# Altium schematic sheet Ethernet.SchDoc
size Legal; SheetNumber: 6; SheetTotal: 11
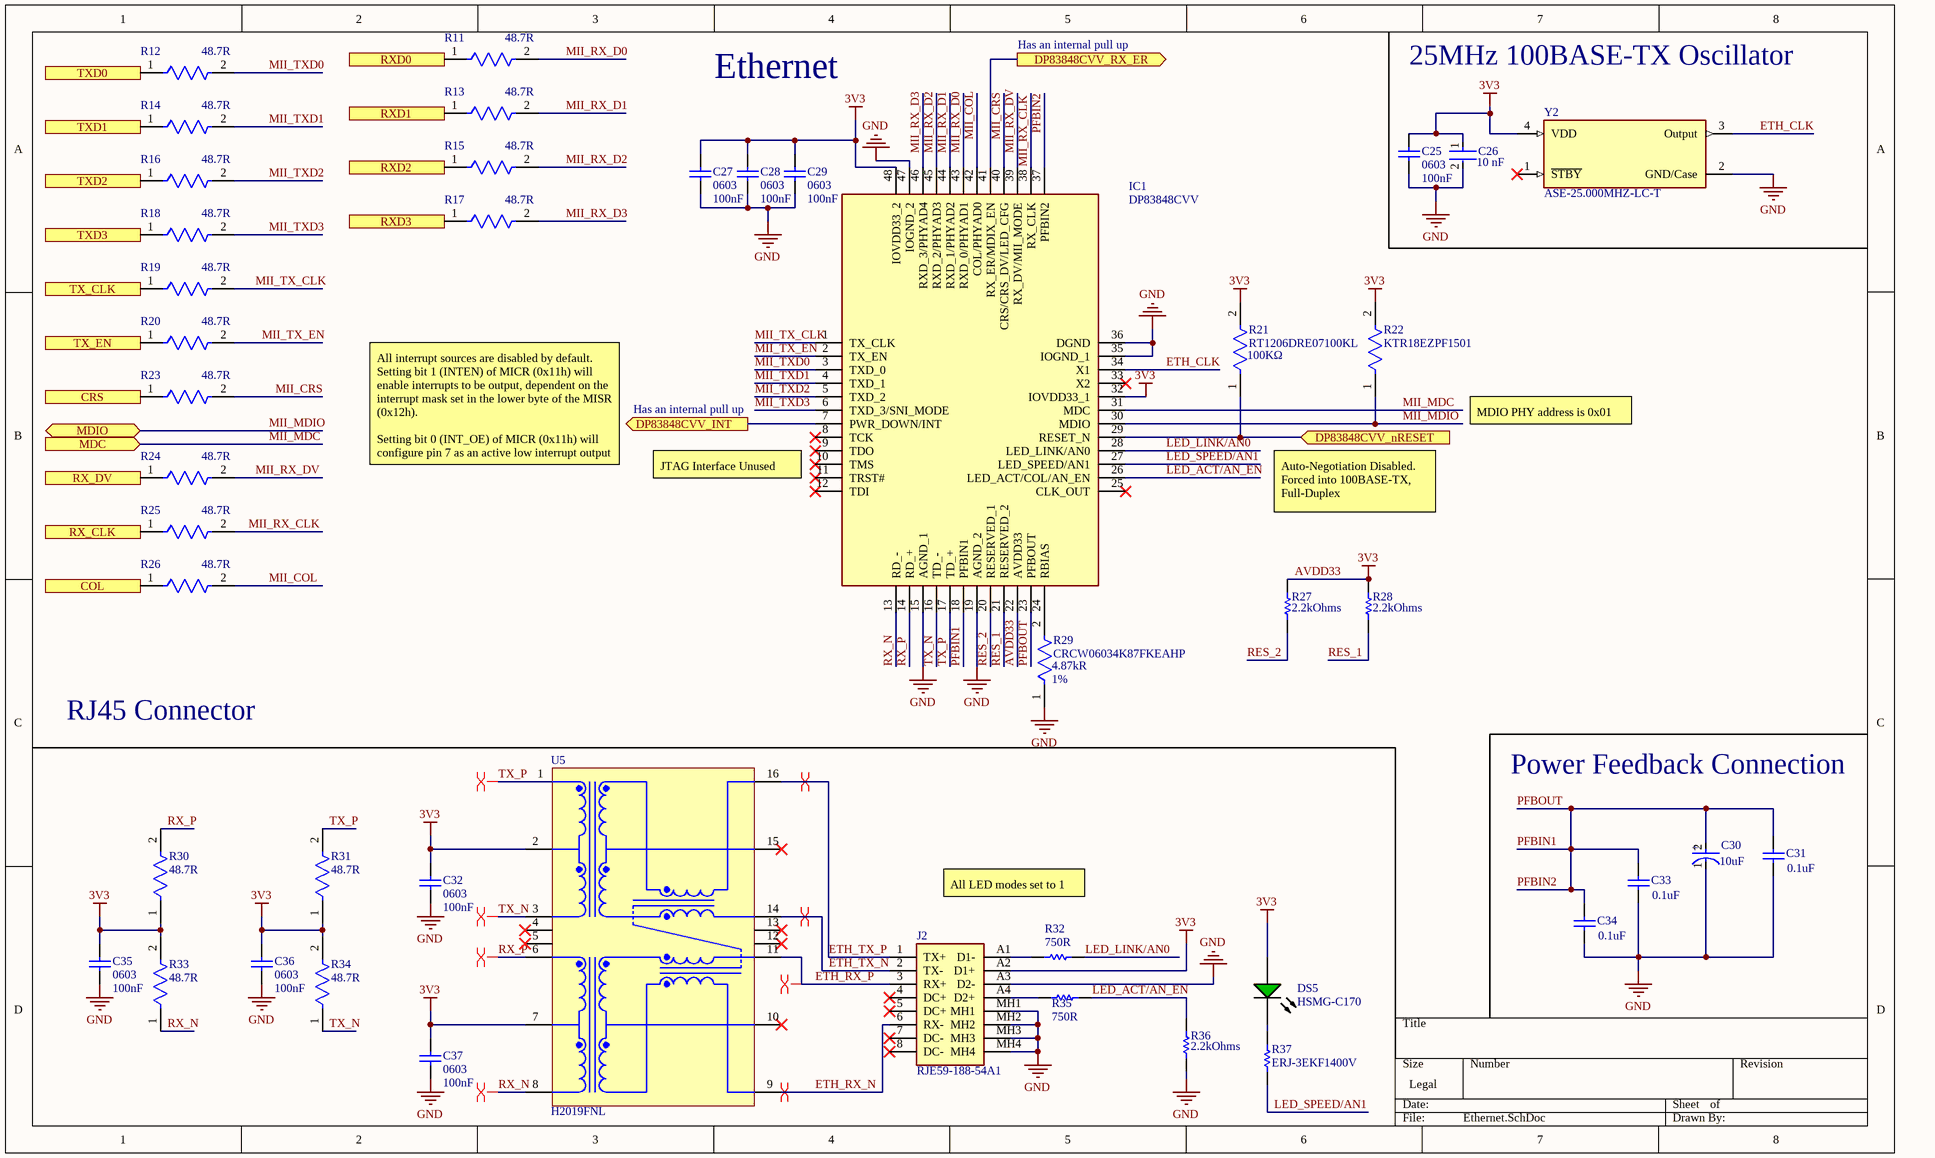
[diagram p0: Ethernet.SchDoc]

## Parts
C25  Case Code (Imperial): 0603  Capacitance: 100nF  [CAPC1608X87X35NL15T15]  (hidden comment: C0603X104K5RACTU)
C26  value 10 nF  [FP-CC0603-DA-MFG]  (hidden comment: CC0603KRX7R9BB103)
C27  Case Code (Imperial): 0603  Capacitance: 100nF  [CAPC1608X87X35NL15T15]  (hidden comment: C0603X104K5RACTU)
C28  Case Code (Imperial): 0603  Capacitance: 100nF  [CAPC1608X87X35NL15T15]  (hidden comment: C0603X104K5RACTU)
C29  Case Code (Imperial): 0603  Capacitance: 100nF  [CAPC1608X87X35NL15T15]  (hidden comment: C0603X104K5RACTU)
C30  Capacitance: 10uF  [FP-T491B106K025AT-MFG]  (hidden comment: T491B106K025AT)
C31  value 0.1uF  [CAPC2113X120X50NL20T30]  (hidden comment: TAJR104K020RNJ)
C32  Case Code (Imperial): 0603  Capacitance: 100nF  [CAPC1608X87X35NL15T15]  (hidden comment: C0603X104K5RACTU)
C33  value 0.1uF  [CAPC2113X120X50NL20T30]  (hidden comment: TAJR104K020RNJ)
C34  value 0.1uF  [CAPC2113X120X50NL20T30]  (hidden comment: TAJR104K020RNJ)
C35  Case Code (Imperial): 0603  Capacitance: 100nF  [CAPC1608X87X35NL15T15]  (hidden comment: C0603X104K5RACTU)
C36  Case Code (Imperial): 0603  Capacitance: 100nF  [CAPC1608X87X35NL15T15]  (hidden comment: C0603X104K5RACTU)
C37  Case Code (Imperial): 0603  Capacitance: 100nF  [CAPC1608X87X35NL15T15]  (hidden comment: C0603X104K5RACTU)
DS5  HSMG-C170  [AVAG-HSMX-C170_V]
IC1  DP83848CVV  [QFP50P900X900X160-48N]
J2  RJE59-188-54A1  [RJE5918854A1]
R11  Resistance: 48.7R  [FP-CRCW0603-e3-IPC_C]  (hidden comment: CRCW060348R7FKEA)
R12  Resistance: 48.7R  [FP-CRCW0603-e3-IPC_C]  (hidden comment: CRCW060348R7FKEA)
R13  Resistance: 48.7R  [FP-CRCW0603-e3-IPC_C]  (hidden comment: CRCW060348R7FKEA)
R14  Resistance: 48.7R  [FP-CRCW0603-e3-IPC_C]  (hidden comment: CRCW060348R7FKEA)
R15  Resistance: 48.7R  [FP-CRCW0603-e3-IPC_C]  (hidden comment: CRCW060348R7FKEA)
R16  Resistance: 48.7R  [FP-CRCW0603-e3-IPC_C]  (hidden comment: CRCW060348R7FKEA)
R17  Resistance: 48.7R  [FP-CRCW0603-e3-IPC_C]  (hidden comment: CRCW060348R7FKEA)
R18  Resistance: 48.7R  [FP-CRCW0603-e3-IPC_C]  (hidden comment: CRCW060348R7FKEA)
R19  Resistance: 48.7R  [FP-CRCW0603-e3-IPC_C]  (hidden comment: CRCW060348R7FKEA)
R20  Resistance: 48.7R  [FP-CRCW0603-e3-IPC_C]  (hidden comment: CRCW060348R7FKEA)
R21  RT1206DRE07100KL  Resistance: 100KΩ  [FP-RT1206-MFG]
R22  KTR18EZPF1501  [FP-KTR18-IPC_C]
R23  Resistance: 48.7R  [FP-CRCW0603-e3-IPC_C]  (hidden comment: CRCW060348R7FKEA)
R24  Resistance: 48.7R  [FP-CRCW0603-e3-IPC_C]  (hidden comment: CRCW060348R7FKEA)
R25  Resistance: 48.7R  [FP-CRCW0603-e3-IPC_C]  (hidden comment: CRCW060348R7FKEA)
R26  Resistance: 48.7R  [FP-CRCW0603-e3-IPC_C]  (hidden comment: CRCW060348R7FKEA)
R27  Resistance: 2.2kOhms  [RESC1608X55X25LL10T15]  (hidden comment: RC0603FR-072K2L)
R28  Resistance: 2.2kOhms  [RESC1608X55X25LL10T15]  (hidden comment: RC0603FR-072K2L)
R29  CRCW06034K87FKEAHP  Tolerance: 1%  Resistance: 4.87kR  [FP-CRCW0603-HPe3-MFG]
R30  Resistance: 48.7R  [FP-CRCW0603-e3-IPC_C]  (hidden comment: CRCW060348R7FKEA)
R31  Resistance: 48.7R  [FP-CRCW0603-e3-IPC_C]  (hidden comment: CRCW060348R7FKEA)
R32  Resistance: 750R  [RESC1609X50X30ML10T20]  (hidden comment: CRCW0603750RJNEA)
R33  Resistance: 48.7R  [FP-CRCW0603-e3-IPC_C]  (hidden comment: CRCW060348R7FKEA)
R34  Resistance: 48.7R  [FP-CRCW0603-e3-IPC_C]  (hidden comment: CRCW060348R7FKEA)
R35  Resistance: 750R  [RESC1609X50X30ML10T20]  (hidden comment: CRCW0603750RJNEA)
R36  Resistance: 2.2kOhms  [RESC1608X55X25LL10T15]  (hidden comment: RC0603FR-072K2L)
R37  ERJ-3EKF1400V  [RESC1608X55X30NL15T15]
U5  H2019FNL  [PULS-H2019FNL_V]
Y2  ASE-25.000MHZ-LC-T  [FP-ASE-MFG]

## Ports
COL (out, see WSB[2C]), CRS (out, see WSB[2C]), DP83848CVV_INT (out, see WSB[2D], Processor[3C]), DP83848CVV_nRESET (in, see WSB[2D], Processor[2D]), DP83848CVV_RX_ER (out, see WSB[2D], Processor[2A]), MDC (in, see WSB[2C]), MDIO (bidir, see WSB[2C]), RX_CLK (out, see WSB[2C]), RX_DV (out, see WSB[2C]), RXD0 (out, see WSB[2C]), RXD1 (out, see WSB[2C]), RXD2 (out, see WSB[2D]), RXD3 (out, see WSB[2D]), TX_CLK (out, see WSB[2C]), TX_EN (in, see WSB[2C]), TXD0 (in, see WSB[2C]), TXD1 (in, see WSB[2C]), TXD2 (in, see WSB[2C]), TXD3 (in, see WSB[2C])

## Nets
AVDD33: C25.1 C26.1 C27.1 C28.1 C29.1 C32.1 C35.1 C36.1 C37.1 DS5.1(A) IC1.22(AVDD33) IC1.32(IOVDD33_1) IC1.48(IOVDD33_2) J2.A2(D1+) R21.2 R22.2 R27.2 R28.2 R30.1 R31.1 R33.2 R34.2 U5.2(TCT) U5.7(RCT) Y2.4(VDD)  [also labelled 3V3]
GND: C25.2 C26.2 C27.2 C28.2 C29.2 C30.1(C) C31.1 C32.2 C33.1 C34.1 C35.2 C36.2 C37.2 IC1.15(AGND_1) IC1.19(AGND_2) IC1.35(IOGND_1) IC1.36(DGND) IC1.47(IOGND_2) J2.A3(D2-) J2.MH1 J2.MH2 J2.MH3 J2.MH4 R29.1 R36.1 Y2.2(GND/Case)
COL: R26.1 ; port COL
CRS: R23.1 ; port CRS
DP83848CVV_INT: IC1.7(PWR_DOWN/INT) ; port DP83848CVV_INT
DP83848CVV_nRESET: IC1.29(RESET_N) R21.1 ; port DP83848CVV_nRESET
DP83848CVV_RX_ER: IC1.41(RX_ER/MDIX_EN) ; port DP83848CVV_RX_ER
ETH_CLK: IC1.34(X1) Y2.3(Output)
ETH_RX_N: J2.6(RX-) U5.9(RX-)
ETH_RX_P: J2.3(RX+) U5.11(RX+)
ETH_TX_N: J2.2(TX-) U5.14(TX-)
ETH_TX_P: J2.1(TX+) U5.16(TX+)
LED_ACT/AN_EN: IC1.26(LED_ACT/COL/AN_EN) R35.2 R36.2
LED_LINK/AN0: IC1.28(LED_LINK/AN0) R32.2
LED_SPEED/AN1: IC1.27(LED_SPEED/AN1) R37.1
MII_COL: IC1.42(COL/PHYAD0) R26.2
MII_CRS: IC1.40(CRS/CRS_DV/LED_CFG) R23.2
MII_MDC: IC1.31(MDC) ; port MDC
MII_MDIO: IC1.30(MDIO) R22.1 ; port MDIO
MII_RX_CLK: IC1.38(RX_CLK) R25.2
MII_RX_D0: IC1.43(RXD_0/PHYAD1) R11.2
MII_RX_D1: IC1.44(RXD_1/PHYAD2) R13.2
MII_RX_D2: IC1.45(RXD_2/PHYAD3) R15.2
MII_RX_D3: IC1.46(RXD_3/PHYAD4) R17.2
MII_RX_DV: IC1.39(RX_DV/MII_MODE) R24.2
MII_TX_CLK: IC1.1(TX_CLK) R19.2
MII_TX_EN: IC1.2(TX_EN) R20.2
MII_TXD0: IC1.3(TXD_0) R12.2
MII_TXD1: IC1.4(TXD_1) R14.2
MII_TXD2: IC1.5(TXD_2) R16.2
MII_TXD3: IC1.6(TXD_3/SNI_MODE) R18.2
PFBIN1: C30.2(A) C31.2 C33.2 C34.2 IC1.18(PFBIN1) IC1.23(PFBOUT) IC1.37(PFBIN2)  [also labelled PFBIN2, PFBOUT]
RES_1: IC1.21(RESERVED_2) R28.1
RES_2: IC1.20(RESERVED_1) R27.1
RX_CLK: R25.1 ; port RX_CLK
RX_DV: R24.1 ; port RX_DV
RX_N: IC1.13(RD_-) R33.1 U5.8(RD-)
RX_P: IC1.14(RD_+) R30.2 U5.6(RD+)
RXD0: R11.1 ; port RXD0
RXD1: R13.1 ; port RXD1
RXD2: R15.1 ; port RXD2
RXD3: R17.1 ; port RXD3
TX_CLK: R19.1 ; port TX_CLK
TX_EN: R20.1 ; port TX_EN
TX_N: IC1.16(TD_-) R34.1 U5.3(TD-)
TX_P: IC1.17(TD_+) R31.2 U5.1(TD+)
TXD0: R12.1 ; port TXD0
TXD1: R14.1 ; port TXD1
TXD2: R16.1 ; port TXD2
TXD3: R18.1 ; port TXD3
NetDS5_2: DS5.2(K) R37.2
NetIC1_24: IC1.24(RBIAS) R29.2
NetJ2_A1: J2.A1(D1-) R32.1
NetJ2_A4: J2.A4(D2+) R35.1

Not connected (* = marked no-connect by the designer): IC1 8(TCK)* 9(TDO)* 10(TMS)* 11(TRST#)* 12(TDI)* 25(CLK_OUT)* 33(X2)*; J2 4(DC+)* 5(DC+)* 7(DC-)* 8(DC-)*; U5 4(NC)* 5(NC)* 10(RXCT)* 12(NC)* 13(NC)* 15(TXCT)*; Y2 1(~{STBY})*

## Layout directives
differential pair: ETH_RX_N, ETH_RX_P, ETH_TX_N, ETH_TX_P, RX_N, RX_P, TX_N, TX_P

## Notes on the sheet
- Ethernet
- Has an internal pull up
- 25MHz 100BASE-TX Oscillator
- MDIO PHY address is 0x01
- All interrupt sources are disabled by default. Setting bit 1 (INTEN) of MICR (0x11h) will enable interrupts to be output, dependent on the interrupt mask set in the lower byte of the MISR (0x12h).
  Setting bit 0 (INT_OE) of MICR (0x11h) will configure pin 7 as an active low interrupt output
- (near IC1) JTAG Interface Unused
- Auto-Negotiation Disabled. Forced into 100BASE-TX, Full-Duplex
- RJ45 Connector
- Power Feedback Connection
- All LED modes set to 1
- (in symbol CMP-03017-000036-1) +

## Library data of the parts
C25 C27-C29 C32 C35-C37 = CMP-2006-03300-1: Manufacturer: Kemet; Dielectric Material: Ceramic; Tolerance: 10%; Voltage Rating: 50V; Dielectric: X7R; Dissipation Factor: 2.5%; Part Number: C0603X104K5RACTU; Supplier 1: Digi-Key; Supplier Part Number 1: 399-7969-1-ND; Manufacturer Part Number: C0603X104K5RACTU; Stock 1: 2206541; Pricing 1: 1 = 0.21000, 10 = 0.14500, 100 = 0.07340, 500 = 0.05024, 1000 = 0.04444 (USD); RoHS: Yes; Mount: Surface Mount; Case/Package: 0603; Number of Pins: 2; Case Code (Metric): 1608; Min Operating Temperature: -55°C; Max Operating Temperature: 125°C; Packaging: Tape and Reel; Package Quantity: 1; Voltage Rating (DC): 50V; Termination: SMD/SMT; Voltage: 50V; Features: Soft Termination; Length: 1.6mm; Height: 0.8mm; Width: 0.8mm; Depth: 0.8mm; Thickness: 0.034inch; Radiation Hardening: No; REACH SVHC: No SVHC; ComponentLink1URL: https://datasheet.ciiva.com/7823/1776088-7823908.pdf?src-supplier=Element14; ComponentLink1Description: https://datasheet.ciiva.com/7823/1776088-7823908.pdf?src-supplier=Element14; ComponentLink2URL: https://datasheet.ciiva.com/26948/getdatasheetpartid-385607-26948458.pdf?src-supplier=Verical; ComponentLink2Description: https://datasheet.ciiva.com/26948/getdatasheetpartid-385607-26948458.pdf?src-supplier=Verical; ComponentLink3URL: https://datasheet.ciiva.com/7823/1776088-7823909.pdf?src-supplier=Element14; ComponentLink3Description: https://datasheet.ciiva.com/7823/1776088-7823909.pdf?src-supplier=Element14; ComponentLink4URL: https://datasheet.ciiva.com/6279/kem-c1013-x7r-ft-cap-smd-6279993.pdf?src-supplier=Digi-Key; ComponentLink4Description: https://datasheet.ciiva.com/6279/kem-c1013-x7r-ft-cap-smd-6279993.pdf?src-supplier=Digi-Key; ComponentLink5URL: https://datasheet.ciiva.com/28533/1918693-28533212.pdf?src-supplier=Element14; ComponentLink5Description: https://datasheet.ciiva.com/28533/1918693-28533212.pdf?src-supplier=Element14; ComponentLink6URL: https://datasheet.ciiva.com/6279/kem-c1013-x7r-ft-cap-smd-6279999.pdf?src-supplier=Digi-Key; ComponentLink6Description: https://datasheet.ciiva.com/6279/kem-c1013-x7r-ft-cap-smd-6279999.pdf?src-supplier=Digi-Key; ComponentLink7URL: https://datasheet.ciiva.com/6279/kem-c1013-x7r-ft-cap-smd-6279990.pdf?src-supplier=Digi-Key; ComponentLink7Description: https://datasheet.ciiva.com/6279/kem-c1013-x7r-ft-cap-smd-6279990.pdf?src-supplier=Digi-Key; ComponentLink8URL: https://datasheet.ciiva.com/14597/70096394-14597743.pdf?src-supplier=Allied+Electronics; ComponentLink8Description: https://datasheet.ciiva.com/14597/70096394-14597743.pdf?src-supplier=Allied+Electronics
C26 = CMP-2100-03600-2: CAP CER 10000PF 50V X7R 0603; Manufacturer: YAGEO; Tolerance: 0.1; Material: Ceramic; Temperature Coefficient: 15%; Mouser Description: Multilayer Ceramic Capacitor, CC Series, 0.01 - F, - 10%, X7R, 50 V, 0603 [1608 Metric]; Digikey Description: CAP CER 10000PF 50V X7R 0603; Height: 0.9mm; Category: Cap; Temperature Characteristic: X7R; Footprint Url: http://www.yageo.com/exep/pages/download/literatures/UPY-C_GEN_24.pdf; Lead Free: Yes; Voltage Rating: 50 V; Manufacturer Part Number: CC0603KRX7R9BB103; Temperature: -55°C to +125°C; Device Class L3: Ceramic Capacitors; ComponentLink2Description: Datasheet; Voltage: 50 V; Package: CC0603-DA; Octopart: https://octopart.com/cc0603krx7r9bb103-yageo-192938; Automotive: No; Temperature Range High: +125°C; Temperature Range Low: -55°C; RoHS: TRUE; Device Class L1: Passive Components; ComponentLink2URL: http://www.yageo.com/documents/recent/UPY-GPHC_X7R_6.3V-to-50V_18.pdf; Device Class L2: Capacitors; Capacitance: 10 nF
C30 = CMP-03017-000036-1: CAP TANT 10UF 10% 25V 1411; Life (Hours): 2000Hour; Leakage Current: 2.5uA; ESR (Equivalent Series Resistance): 3R; Ripple Current: 168mA; Polarity: Polar; Dielectric Material: Tantalum; Dissipation Factor: 8%; Package Quantity: 1; Series: T491; Features: General Purpose; Lead Free: Lead Free; Termination: SMD/SMT; Packaging: Tape and Reel; Max Operating Temperature: 125°C; Number of Pins: 2; Case Code (Imperial): 1411; Height - Seated (Max): 0.083inch; Min Operating Temperature: -55°C; Case/Package: 1411; Voltage: 25V; Tolerance: 10%; REACH SVHC: No SVHC; Case Code (Metric): 3528; Depth: 2.8mm; Mount: Surface Mount; Voltage Rating (DC): 25V; Length: 3.5mm; Voltage Rating: 25V; Construction: Flat; RoHS Compliant: Yes; Height: 1.9mm; Width: 0.11inch; Radiation Hardening: No
C31 C33 C34 = CMP-2007-04027-1: Manufacturer: AVX Interconnect / Elco; Part Number: TAJR104K020RNJ
DS5 = CMP-2000-05062-1: Chip LED, Green, 2.2 V, -40 to 85 degC, 2-Pin SMD, Pb-Free, Tape and Reel; Manufacturer: Avago; No. of Pins: 2; Peak Wavelength: 570nm; SVHC: NoSVHC(16-Jun-2014); Dominant Wavelength: 572nm; Forward Current If: 20mA; Viewing Angle: 170deg; Lens Shape: Rectangular; PIV Max: 5V; External Width: 1.25mm; LED Type: Standard; External Depth: 0.8mm; Opto Mounting Orientation: Top; Luminous Intensity: 15mcd; Luminous Intensity Min: 4mcd; Forward Voltage VF Max: 2.6V; External Length / Height: 2mm; Bulb Size: 1.25mmx1.4mm; Light Area Height: 1mm; Voltage Vf Typ: 2.2V; Operating Temperature Max: 85degC; Datasheet Version: Oct-08; MSL: MSL2A-4weeks; Peak Forward Current: 20mA; Package Description: 2-Pin Surface Mount Device, Body 2 x 1.25 mm, Height 0.8 mm; Datasheet URL: https://datasheet.ciiva.com/29280/180495-da-01-en-chip-led-hsmg-c170-gelb-gruen-29280971.pdf; Storage Temperature Min: -40degC; LED Colour: Green; Wavelength Typ: 570nm; Mounting Type: SMD; Forward Current If Max: 20mA; Dominant Wavelength Typ: 572nm; LED Mounting: SMD; Operating Temperature Range: -30degCto+85degC; Operating Temperature Min: -30degC; Manufacturer URL: http://www.avagotech.com/; Packaging: CutTape; Luminous Intensity Typ: 15mcd; Package Reference: HSMX-C170; Storage Temperature Max: 85degC; Opto Case Style: SMD; Forward Voltage: 2.2V
IC1 = DP83848CVV: Integrated Circuit; Manufacturer_Name: Texas Instruments; Datasheet Link: https://www.ti.com/lit/ds/symlink/dp83848c.pdf?ts=1623408916131&ref_url=https%253A%252F%252Fwww.ti.com%252Fstore%252Fti%252Fen%252Fp%252Fproduct%252F%253Fp%253DDP83848CVV%252FNOPB; Height: 1.6mm; Manufacturer_Part_Number: DP83848CVV; Mouser Part Number: N/A; Mouser Price/Stock: https://www.mouser.co.uk/ProductDetail/Texas-Instruments/DP83848CVV?qs=7X5t%252BdzoRHD7qwP%2FAptr%2Fg%3D%3D; Supplier 1: Mouser; Supplier Part Number 1: 926-DP83848CVV/NOPB
J2 = RJE59-188-54A1: Connector; Manufacturer_Name: Amphenol; Datasheet Link: https://datasheet.datasheetarchive.com/originals/distributors/DKDS-29/572439.pdf; Height: 14.99mm; Manufacturer_Part_Number: RJE59-188-54A1; Mouser Part Number: 523-RJE59-188-54A1; Mouser Price/Stock: https://www.mouser.co.uk/ProductDetail/Amphenol-Commercial-Products/RJE59-188-54A1?qs=cbcdnthhinTKLWQ%2FS%2FbVLA%3D%3D; Supplier 1: Avnet; Supplier Part Number 1: 92Y3914
R11-R20 R23-R26 R30 R31 R33 R34 = CMP-02407-010834-1: RES Thick Film, 48.7Ω, 1%, 0.1W, 100ppm/°C, 0603; Max Power Dissipation: 100mW; Voltage Rating: 75V; Contact Plating: Tin; Number of Pins: 2; Max Operating Temperature: 155°C; Weight: 7.1E-05oz; Temperature Coefficient: 100ppm/°C; Tolerance: 1%; Radiation Hardening: No; Length: 1.55mm; Depth: 0.85mm; Number of Terminations: 2; Features: Automotive AEC-Q200; Min Operating Temperature: -55°C; Package Quantity: 10; Width: 0.033inch; Composition: Thick Film; Case Code (Imperial): 0603; Power Rating: 100mW; Height: 0.02inch; Military Standard: Not; Case Code (Metric): 1608; Packaging: Tape and Reel; Case/Package: 0603
R21 = CMP-2003-04271-2: RES SMD 100K OHM 0.5% 1/4W 1206; Manufacturer: Yageo; Value: 100KΩ; Power Rating: 0.25W; Tolerance: 0.0001; Temperature Coefficient: 50 ppm/°C; Voltage Rating: 200V; Mouser Description: Res Thin Film 1206 100K Ohm 0.5% 1/4W ±50ppm/°C Molded SMD Paper T/R; Series: RT; RoHS: TRUE; Device Class L3: Chip SMD Resistors; Ipc Land Pattern Name: RESC310160X55; Lead Free: Yes; Package: RT1206; Height: 0.65mm; Composition: Thin Film; Temperature Range Low: -55°C; Device Class L2: Resistors; Octopart: https://octopart.com/rt1206dre07100kl-yageo-1189867; ComponentLink2Description: Datasheet; ComponentLink2URL: http://www.yageo.com/documents/recent/PYu-RT_1-to-0.01_RoHS_L_9.pdf; Digikey Description: RES SMD 100K OHM 0.5% 1/4W 1206; Manufacturer Part Number: RT1206DRE07100KL; Temperature Range High: +155°C; Automotive: No; Temperature: -55°C to +155°C; Device Class L1: Passive Components; Footprint Url: http://www.yageo.com/exep/pages/download/literatures/PYu-R_Mount_10.pdf; Category: Res
R22 = CMP-08839-031800-1: Res Thick Film 1206 1.5kΩ 1% 0.1W ±100ppm/°C Automotive Paper T/R; Resistance: 1.5kR; Max Power Dissipation: 250mW; Width: 0.063inch; Length: 0.126inch; Case Code (Imperial): 1206; Max Operating Temperature: 155°C; Package Quantity: 1; Case Code (Metric): 3216; RoHS Compliant: Yes; Features: Automotive AEC-Q200; Height: 0.026inch; Min Operating Temperature: -55°C; Series: KTR; Resistor Type: Thick Film; Temperature Coefficient: 100ppm/°C; Packaging: Tape and Reel; Number of Terminations: 2; Tolerance: 1%; Case/Package: 1206
R27 R28 R36 = CMP-2000-06934-1: Thick Film Resistor, 2.2 KOhm, 100 mW, 50 V, +/- 1%, -55 to 155 degC, 2-Pin SMD (0603), RoHS, Tape and Reel; Manufacturer: Yageo; Temperature Coefficient: 100PPM/C; Voltage Rating: 50V; Power Rating: 100mW; Tolerance: 1%; Datasheet Version: Rev. 7, 05/2017; Case Code - mm: 1608; Series: RC; Mounting Technology: SurfaceMount; Package Description: 2-Pin Surface Mount Device, Body 1.6 x 0.8 mm; Case Code - in: 0603; Package Reference: 0603; Product: ThickFilmResistorsGeneralPurpose; Manufacturer URL: http://www.yageo.com/; Termination Style: SMD/SMT; Operating Temperature Range: -55Cto+155C; Datasheet URL: http://www.yageo.com/documents/recent/PYu-RC_Group_51_RoHS_L_7.pdf; Packaging: Reel
R29 = CMP-02407-007715-1: RES Thick Film, 4.87kΩ, 1%, 0.33W, 100ppm/°C, 0603; Max Power Dissipation: 250mW; Package Quantity: 5000; Height: 0.022inch; Number of Terminations: 2; Termination: Wraparound; Min Operating Temperature: -55°C; Lead Free: Lead Free; Power Rating: 250mW; Features: Automotive AEC-Q200; Mount: Surface Mount; Temperature Coefficient: 100ppm/°C; Width: 0.033inch; Length: 0.063inch; Packaging: Tape and Reel; Case/Package: 0603; Max Operating Temperature: 155°C; Contact Plating: Tin; Composition: Thick Film
R32 R35 = CMP-2000-03570-1: Manufacturer: Vishay Dale; Part Number: CRCW0603750RJNEA
R37 = CMP-2000-00245-1: Manufacturer: Panasonic; Part Number: ERJ-3EKF1400V
U5 = CMP-2000-06384-1: Telecom Transformer, 100BASE-TX, 0 to 70 degC, 16-Pin SMD, RoHS; Manufacturer: Pulse Electronics; Other Names: 553-2199; Other Related Documents: PackagesFNLvs.NL; Mounting Technology: SurfaceMount; Manufacturer URL: http://www.pulseelectronics.com/; Package Description: 16-Pin Surface Mount Device, Body 12.7 x 9.09 mm, Pitch 1.27 mm; Package Reference: H2019FNL; Standard Package: 40; Datasheet Version: Rev. A, 06/2014; Category: Transformers; Family: PulseTransformers; Datasheet URL: http://productfinder.pulseeng.com/products/datasheets/H2019FNL.pdf
Y2 = CMP-2000-05795-3: XTAL Oscillator 25MHz ±50ppm CMOS 3.3V 4-SMD 3.2mm x 2.5mm; Load Capacitance: 15pF; Min Supply Voltage: 3.135V; Max Supply Voltage: 3.465V; Max Supply Current: 13mA; Max Operating Temperature: 85°C; Termination: SMD/SMT; Operating Frequency: 25 MHz; Height: 0.047inch; Frequency: 25MHz; Mount: Surface Mount; Number of Pins: 4; Length: 3.2mm; Packaging: Tape and Reel; Frequency Stability: 50ppm; Series: ASE; Radiation Hardening: No; Package Quantity: 1000; Width: 2.5mm; Min Operating Temperature: -40°C; Lead Free: Lead Free; Case/Package: SMD/SMT; Depth: 2.5mm; Operating Supply Voltage: 3.3V